# EAGLE design ! NES_IO_US_NOCUT_REV1.5 (EAGLE 9.1.3)
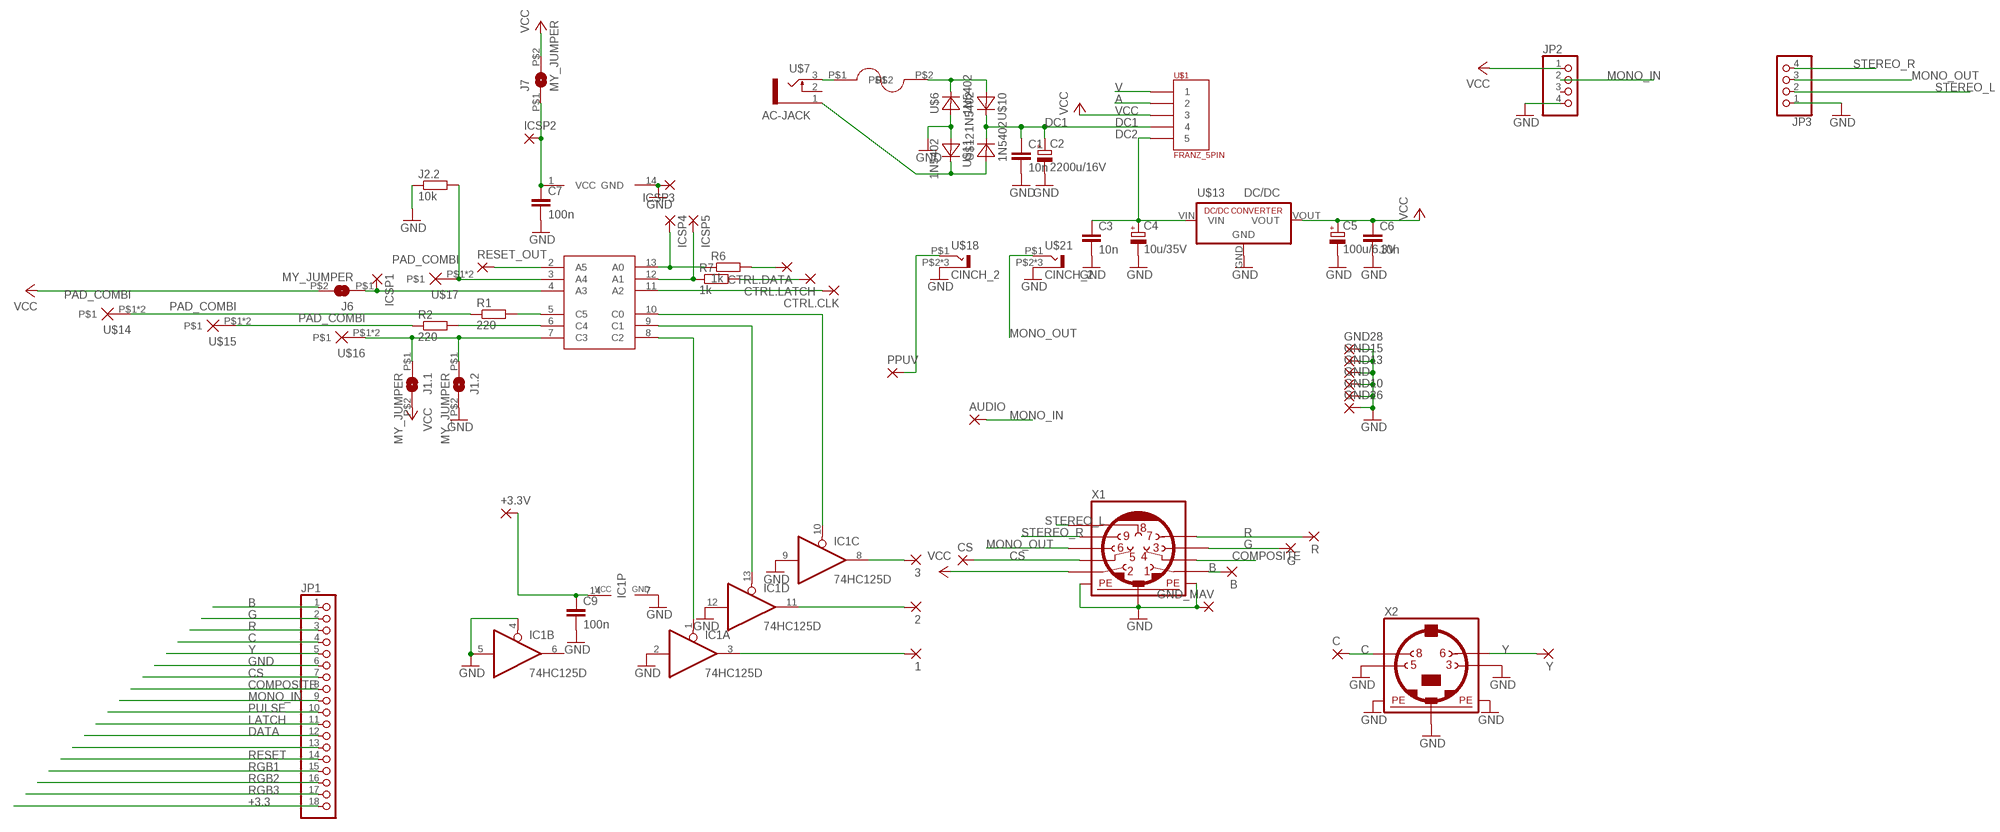
[diagram p0: schematic, sheet 1]

## Parts
1  SMD2  [SMD1,27-2,54]
2  SMD2  [SMD1,27-2,54]
3  SMD2  [SMD1,27-2,54]
+3.3V  SMD2  [SMD1,27-2,54]
AUDIO  SMD2  [SMD1,27-2,54]
B  SMD2  [SMD1,27-2,54]
C  SMD2  [SMD1,27-2,54]
C1  10n  C0805  [Z0805]
C2  2200u/16V  CPOL-EUE5-13  [E5-13]
C3  10n  C0805  [Z0805]
C4  10u/35V  CPOL-EUB  [PANASONIC_B]
C5  100u/6.3V  CPOL-EUD  [PANASONIC_D]
C6  10n  C0805  [Z0805]
C7  100n  C0805  [Z0805]
C9  100n  C0805  [Z0805]
CS  SMD2  [SMD1,27-2,54]
CTRL.CLK  SMD2  [SMD1,27-2,54]
CTRL.DATA  SMD2  [SMD1,27-2,54]
CTRL.LATCH  SMD2  [SMD1,27-2,54]
G  SMD2  [SMD1,27-2,54]
GND  SMD5  [SMD2,54-5,08]
GND10  SMD5  [SMD2,54-5,08]
GND13  SMD5  [SMD2,54-5,08]
GND15  SMD5  [SMD2,54-5,08]
GND26  SMD5  [SMD2,54-5,08]
GND28  SMD5  [SMD2,54-5,08]
GND_MAV  SMD2  [SMD1,27-2,54]
IC1  74HC125D  [SO14]
ICSP1  1,6/0,8  [1,6/0,8]
ICSP2  1,6/0,8  [1,6/0,8]
ICSP3  1,6/0,8  [1,6/0,8]
ICSP4  1,6/0,8  [1,6/0,8]
ICSP5  1,6/0,8  [1,6/0,8]
J1.1  MY_JUMPER  [MYJUMP]
J1.2  MY_JUMPER  [MYJUMP]
J2.2  10k  R0805  [Z0805]
J6  MY_JUMPER  [MYJUMP]
J7  MY_JUMPER  [MYJUMP]
JP1  PINHD-1X18_2.00  [1X18M]
JP2  PINHD-1X04_2.54-S  [1X04-S]
JP3  PINHD-1X04_2.54-S  [1X04-S]
PPUV  SMD2  [SMD1,27-2,54]
R  SMD2  [SMD1,27-2,54]
R1  220  R0805  [Z0805]
R2  220  R0805  [Z0805]
R6  1k  R0805  [Z0805]
R7  1k  R0805  [Z0805]
RESET_OUT  SMD2  [SMD1,27-2,54]
U$1  FRANZ_5PIN  [5X2.22RM4]
U$2  FUSEHOLDER  [FUSEHOLDER]
U$5  PIC16F630_SIMPLE  [PIC16F630]
U$6  1N5402  [DO201]
U$7  AC-JACK  [AC-JACK]
U$10  1N5402  [DO201]
U$11  1N5402  [DO201]
U$12  1N5402  [DO201]
U$13  DC/DC  [RECOM]
U$14  PAD_COMBI  [PAD_COMBI]
U$15  PAD_COMBI  [PAD_COMBI]
U$16  PAD_COMBI  [PAD_COMBI]
U$17  PAD_COMBI  [PAD_COMBI]
U$18  CINCH_2  [CINCH_2]
U$21  CINCH_2  [CINCH_2]
X1  MINI_DIN_9  [M_DIN9]
X2  MINI_DIN_4  [M_DIN4]
Y  SMD2  [SMD1,27-2,54]

## Nets
+3.3: +3.3V.1(P) C9.1 IC1.14(P:VCC) JP1.18
A: U$1.P$2
AC1A: U$2.P$1 U$7.3
AC1B: U$2.P$2 U$6.C U$10.A
AC2: U$7.1 U$11.C U$12.A
B: B.1(P) JP1.1 X1.1
C: C.1(P) JP1.4 X2.8
COMPOSITE: JP1.8 PPUV.1(P) U$18.P$1(T) X1.4
CS: CS.1(P) JP1.7 X1.5
DATA: CTRL.DATA.1(P) JP1.12 R6.2
DC1: C1.1 C2.+ U$1.P$4 U$10.C U$12.C
DC2: C3.1 C4.+ U$1.P$5 U$13.VIN
G: G.1(P) JP1.2 X1.3
GND: C1.2 C2.- C3.2 C4.- C5.- C6.2 C7.2 C9.2 GND10.1(P) GND13.1(P) GND15.1(P) GND26.1(P) GND28.1(P) GND.1(P) GND_MAV.1(P) IC1.2(A:I) IC1.4(B:OE) IC1.5(B:I) IC1.7(P:GND) IC1.9(C:I) IC1.12(D:I) ICSP3.1(P) J1.2.P$2 J2.2.1 JP1.6 JP2.4 JP3.1 U$5.14(GND) U$6.A U$11.A U$13.GND U$18.P$2(S) U$18.P$3(S) U$18.P$4(S) U$21.P$2(S) U$21.P$3(S) U$21.P$4(S) X1.SH1(PE1) X1.SH2(PE2) X1.SH3(PE3) X2.3 X2.5 X2.SH1(PE1) X2.SH2(PE2) X2.SH3(PE3)
LATCH: CTRL.LATCH.1(P) JP1.11 R7.2
MONO_IN: AUDIO.1(P) JP1.9 JP2.2
MONO_OUT: JP3.3 U$21.P$1(T) X1.6
N$12: J2.2.2 U$5.3(A4) U$17.P$1 U$17.P$2
N$13: R1.2 U$5.5(C5)
N$14: R2.2 U$5.6(C4)
N$15: R1.1 U$14.P$1 U$14.P$2
N$16: R2.1 U$15.P$1 U$15.P$2
N$17: J1.1.P$1 J1.2.P$1 U$5.7(C3) U$16.P$1 U$16.P$2
N$23: IC1.10(C:OE) U$5.10(C0)
N$24: IC1.13(D:OE) U$5.9(C1)
N$25: IC1.1(A:OE) U$5.8(C2)
N$29: JP1.13
N$31: C7.1 ICSP2.1(P) J7.P$1 U$5.1(VCC)
N$32: ICSP1.1(P) J6.P$1 U$5.4(A3)
N$33: ICSP4.1(P) R6.1 U$5.13(A0)
N$34: ICSP5.1(P) R7.1 U$5.12(A1)
PULSE: CTRL.CLK.1(P) JP1.10 U$5.11(A2)
R: JP1.3 R.1(P) X1.7
RESET: JP1.14 RESET_OUT.1(P) U$5.2(A5)
RGB1: 3.1(P) IC1.8(C:O) JP1.15
RGB2: 2.1(P) IC1.11(D:O) JP1.16
RGB3: 1.1(P) IC1.3(A:O) JP1.17
STEREO_L: JP3.2 X1.8
STEREO_R: JP3.4 X1.9
V: U$1.P$1
VCC: C5.+ C6.1 J1.1.P$2 J6.P$2 J7.P$2 JP2.1 U$1.P$3 U$13.VOUT X1.2
Y: JP1.5 X2.6 Y.1(P)
Unconnected: IC1.6(B:O) JP2.3 U$7.2

## Library data of the parts
1-3 +3.3V AUDIO B C CS CTRL.CLK CTRL.DATA CTRL.LATCH G GND_MAV PPUV R RESET_OUT Y = wirepad:SMD2: SMD PAD
C1 C3 C6 C7 C9 = snes_div:C0805
C2 = resistor:CPOL-EU: POLARIZED CAPACITOR, European symbol
C4 C5 = rcl:CPOL-EU: POLARIZED CAPACITOR, European symbol
GND GND10 GND13 GND15 GND26 GND28 = wirepad:SMD5: SMD PAD
IC1 = 74xx-eu:74*125: Quad bus BUFFER, 3-state
ICSP1-ICSP5 = wirepad:1,6/0,8: THROUGH-HOLE PAD
J1.1 J1.2 J6 J7 = snes_div:MY_JUMPER
J2.2 R1 R2 R6 R7 = snes_div:R0805
JP1 = pinhead-2:PINHD-1X18: PIN HEADER
JP2 JP3 = pinhead-2:PINHD-1X04: PIN HEADER
U$1 = schnaustlib:FRANZ_5PIN
U$2 = nintendo:FUSEHOLDER
U$5 = snes_div:PIC16F630_SIMPLE
U$6 U$10-U$12 = nintendo:1N5402
U$7 = nintendo:AC-JACK
U$13 = nintendo:DC/DC
U$14-U$17 = MS_Mod:PAD_COMBI
U$18 U$21 = nintendo:CINCH_2
X1 = mini_din:MINI_DIN_9
X2 = mini_din:MINI_DIN_4

## Board
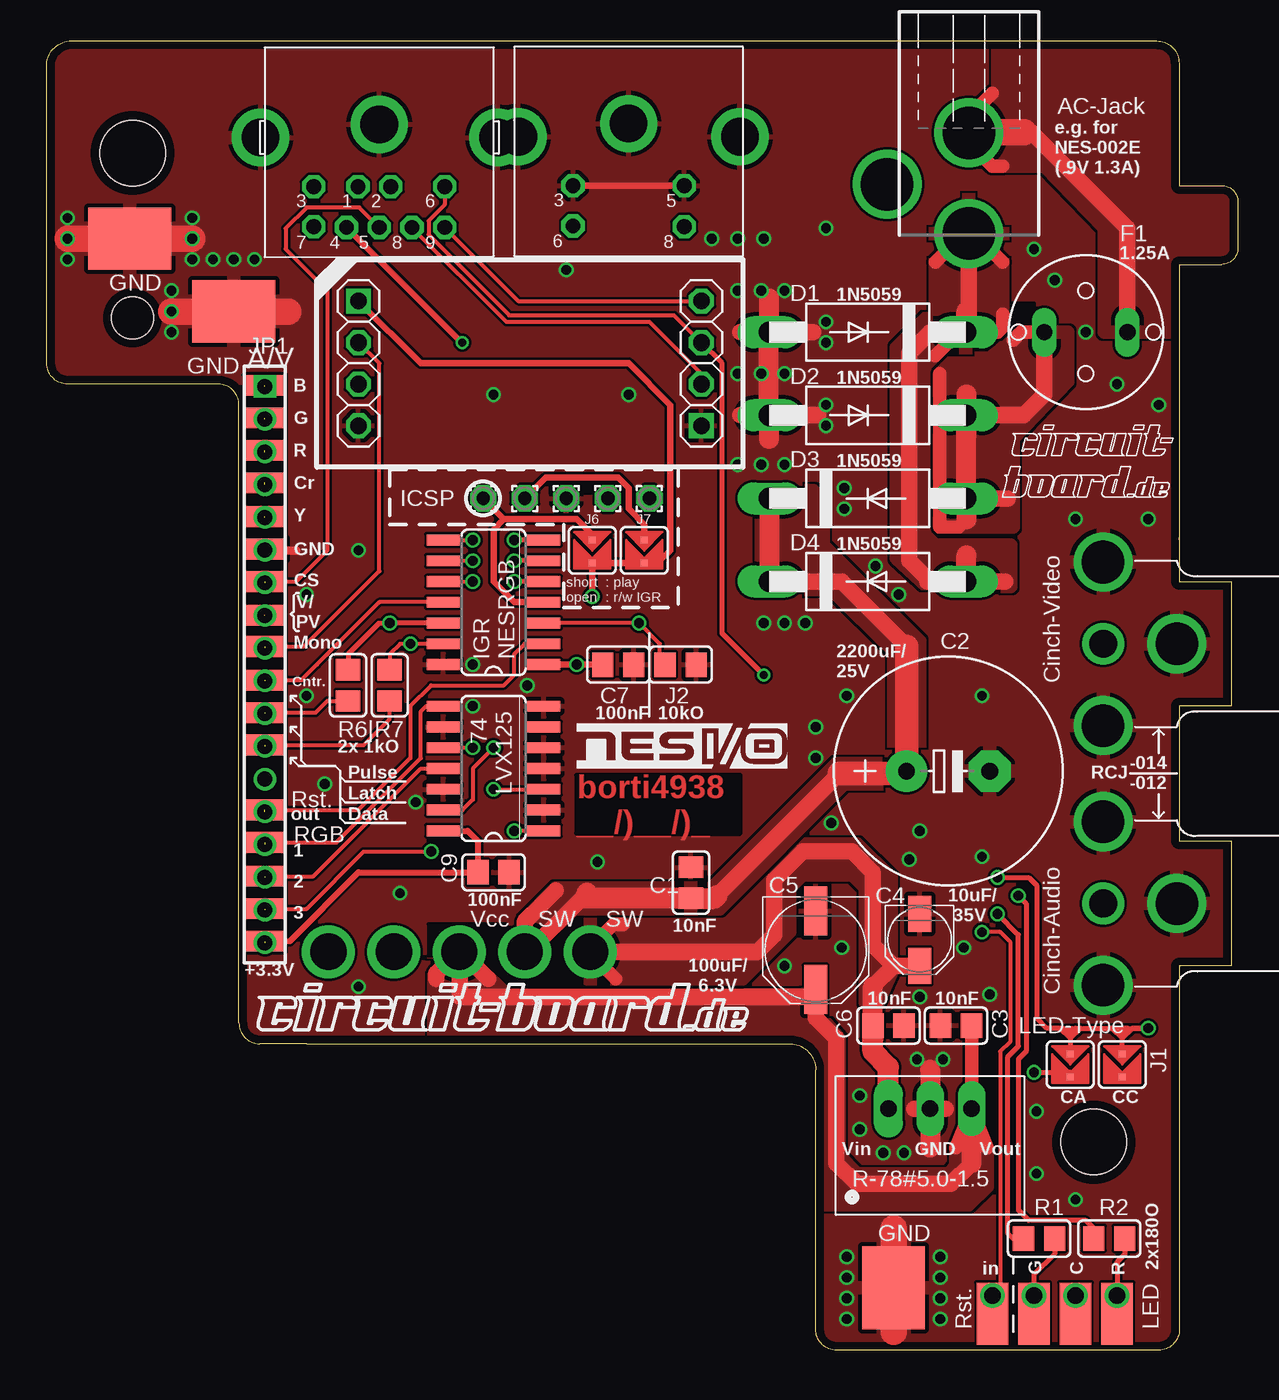
[diagram p1: board, top side]
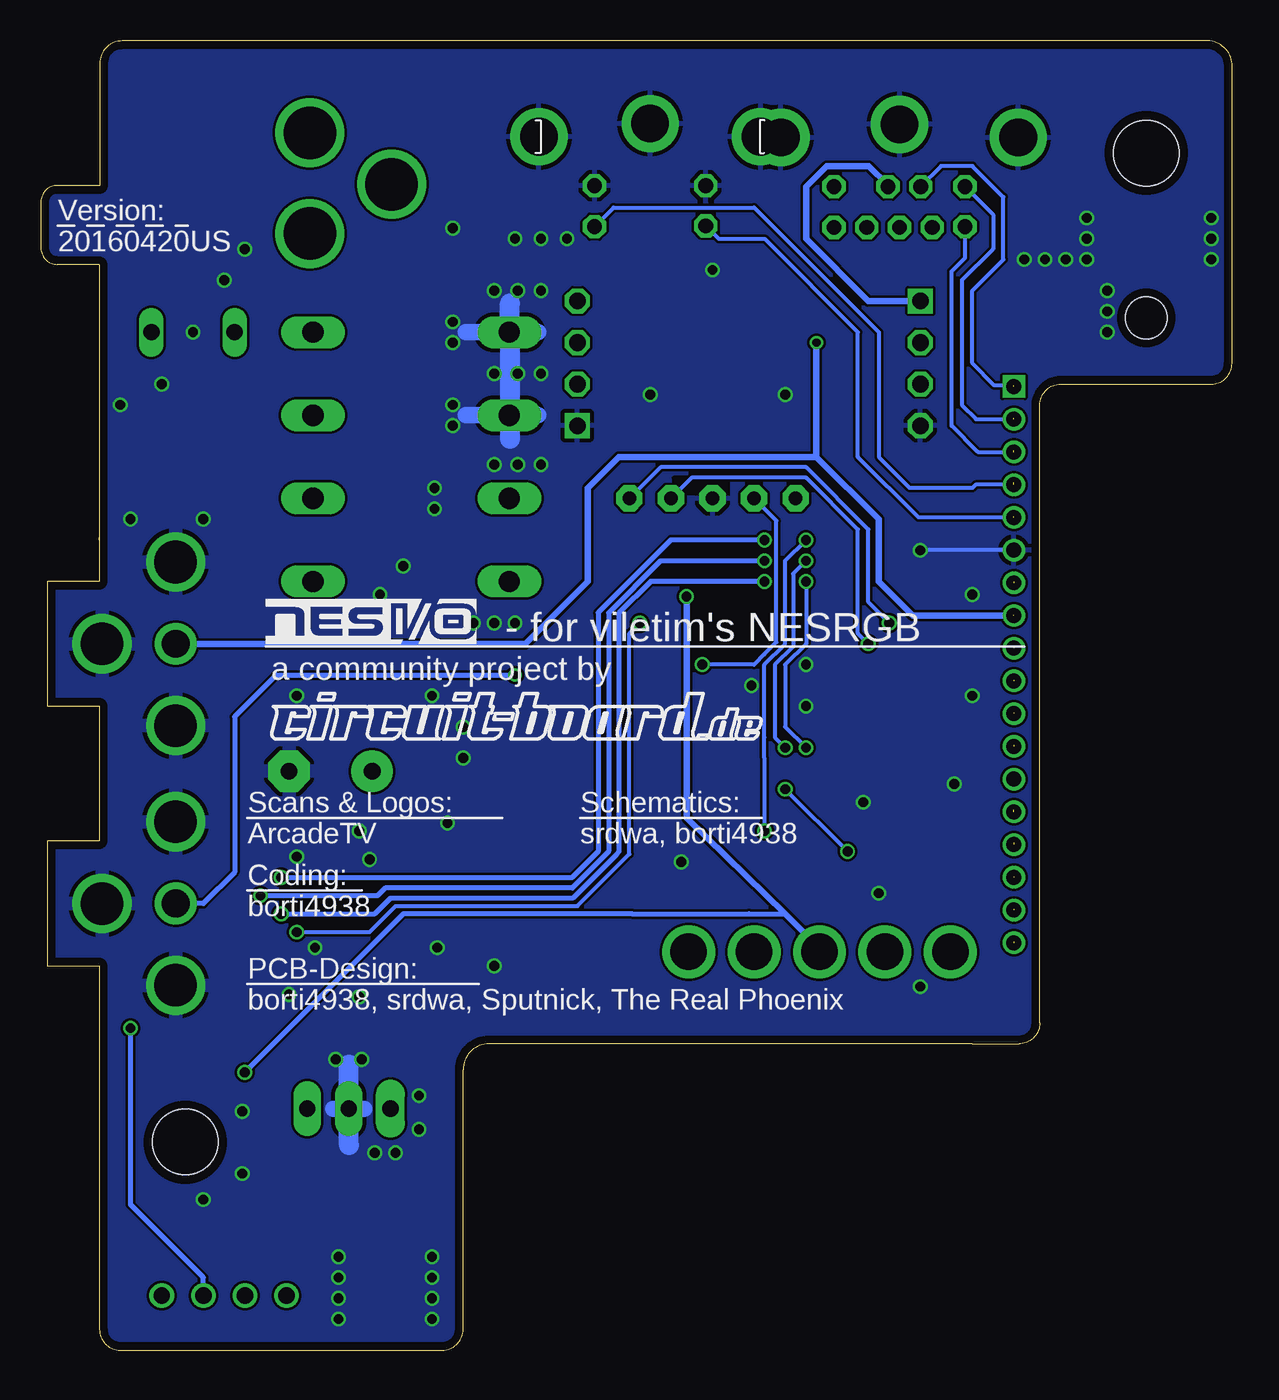
[diagram p2: board, bottom side, seen from below]

Size 72.8 x 80.04 mm. Coordinates in mm from the lower left corner, seen from the top.
Outline: 69.22,49.69 69.22,66.37 71.8,66.37 arc90 72.8,67.37 72.8,70.2 arc90 71.8,71.2 69.2,71.2 69.2,78.67 arc90 67.84,80.04 1.37,80.04 arc90 0.01,78.36 0.01,60.96 0.01,60.33 arc90 1.28,59.05 10.49,59.05 arc-90 11.76,57.78 11.76,20 arc90 13.03,18.73 15.88,18.73 29.85,18.73 45.41,18.73 arc-90 47,17.14 47,1.27 arc90 48.27,0 67.95,0 arc90 69.22,1.27 69.22,23.5 72.4,23.5 72.4,31.11 69.22,31.11 69.22,39.37 72.4,39.37 72.4,46.99 69.22,46.99 69.22,49.53
Outline: 69.22,49.69 69.22,49.53
Outline: 69.22,49.53 arc-7 69.22,49.69
Copper layers (1*16): Top 0.035mm / dielectric 1.6mm / Bottom 0.035mm
Design rules "Elecrow_2-layer_PCB_eagle_rule": minimum track width 6mil, minimum drill 12mil, track to track 6mil, track to pad 6mil, pad to pad 6mil, via to via 8mil, smd to smd 0mil, copper to edge 20mil, drill to drill 10mil, minimum pad ring 6mil, minimum via ring 6mil, stop-mask expansion 0mil, vias tented up to drill 100mil, thermal gap 10mil
Holes 4 mm at 5.26,73.16 63.99,12.73
Holes 2.54 mm at 5.26,63.11
tRestrict: area 62,10.7 to 66,14.7; area 3.2,71.2 to 7.3,75.2; area 23.3,24.1 to 28.1,26; area 30.8,52.4 to 34.1,53.3; area 12.1,24.3 to 14.6,59.7; area 59.1,62.5 to 60.3,64; area 57.3,13.3 to 58.6,20.6
bRestrict: area 62,10.7 to 66,14.7; area 3.2,71.2 to 7.3,75.2; area 30.8,52.4 to 34.1,53.3

### Footprints (pad centres in the part's own frame; a part is rotated, then mirrored left to right if it is on the bottom)
SMD1,27-2,54 = smd 1.27 x 2.54: 1 0,0
Z0805 = smd 1.3 x 1.5: 1 -0.95,0; 2 0.95,0
E5-13 = drill 1.016 pad 2.54: + -2.54,0 | drill 1.016 pad 2.54 octagon: - 2.54,0
PANASONIC_B = smd 2.2 x 1.4: + 1.6,0; - -1.6,0
PANASONIC_D = smd 3 x 1.4: + 2.4,0; - -2.4,0
SMD2,54-5,08 = smd 2.54 x 5.08: 1 0,0
SO14 = smd 0.66 x 2.032: 1 -3.81,-3.073; 2 -2.54,-3.073; 3 -1.27,-3.073; 4 0,-3.073; 5 1.27,-3.073; 6 2.54,-3.073; 7 3.81,-3.073; 8 3.81,3.073; 9 2.54,3.073; 10 1.27,3.073; 11 0,3.073; 12 -1.27,3.073; 13 -2.54,3.073; 14 -3.81,3.073
1,6/0,8 = drill 0.813 pad 1.6 octagon: 1 0,0
MYJUMP = smd 0.406 x 0.406: P$1 -0.635,0; P$2 0.765,0
1X18M = drill 0.914 square: 1 -17,0 | drill 0.914: 2 -15,0; 3 -13,0; 4 -11,0; 5 -9,0; 6 -7,0; 7 -5,0; 8 -3,0; 9 -1,0; 10 1,0; 11 3,0; 12 5,0; 13 7,0; 14 9,0; 15 11,0; 16 13,0; 17 15,0; 18 17,0
1X04-S = drill 1.016 square: 1 -3.81,0 | drill 1.016 octagon: 2 -1.27,0; 3 1.27,0; 4 3.81,0
5X2.22RM4 = drill 2.22: P$1 -8,0; P$2 -4,0; P$3 0,0; P$4 4,0; P$5 8,0
FUSEHOLDER = drill 1 pad 1.422 long: P$1 -2.54,0; P$2 2.54,0
PIC16F630 = smd 0.66 x 2.032: 1 -3.81,-3.073; 2 -2.54,-3.073; 3 -1.27,-3.073; 4 0,-3.073; 5 1.27,-3.073; 6 2.54,-3.073; 7 3.81,-3.073; 8 3.81,3.073; 9 2.54,3.073; 10 1.27,3.073; 11 0,3.073; 12 -1.27,3.073; 13 -2.54,3.073; 14 -3.81,3.073
DO201 = drill 1.3 long: A 6,0; C -6,0
AC-JACK = drill 3.2 pad 4: 1 0,8.57; 2 5,5.57; 3 0,2.42
RECOM = drill 1 pad 1.676 long: GND 0,0; VOUT 2.54,0 | drill 1 pad 1.778 long: VIN -2.54,0
PAD_COMBI = smd 1.93 x 3.81: P$1 0,0 | drill 1: P$2 0,1.111
CINCH_2 = drill 1.7: P$1 0,-4.5 | drill 2.6: P$2 -5,-4.5; P$3 5,-4.5; P$4 0,0
M_DIN9 = drill 0.9 pad 1.422 octagon: 1 -1.3,-3.8; 2 0.7,-3.8; 3 -4,-3.8; 4 -2,-6.3; 5 0,-6.3; 6 4,-3.8; 7 -4,-6.25; 8 2,-6.3; 9 4,-6.3 | drill 2.3 pad 3.5: SH1 7.25,-0.8; SH2 0,0; SH3 -7.25,-0.8
M_DIN4 = drill 0.9 pad 1.422 octagon: 3 -3.4,-3.75; 5 3.4,-3.75; 6 -3.4,-6.2; 8 3.4,-6.25 | drill 2.3 pad 3.5: SH1 6.8,-0.75; SH2 0,0.05; SH3 -6.75,-0.75

### Placement (x,y rotation side)
1  13.34,26.99 270 top
2  13.34,28.97 270 top
3  13.34,31.04 270 top
+3.3V  13.34,25 90 top
AUDIO  13.34,43.02 90 top
B  13.34,58.98 90 top
C  13.34,53.02 90 top
C1  39.38,28.57 90 top
C2  55.09,35.4 0 top
C3  51.44,19.84 0 top
C4  53.35,25.08 270 top
C5  47,24.45 270 top
C6  55.57,19.84 180 top
C7  34.93,41.91 0 top
C9  27.31,29.21 0 top
CS  13.34,46.99 90 top
CTRL.CLK  13.34,40.96 270 top
CTRL.DATA  13.34,36.99 270 top
CTRL.LATCH  13.34,38.97 270 top
G  13.34,56.99 90 top
GND  5.09,68.58 90 top
GND10  51.13,3.81 180 top
GND13  52.4,3.81 0 top
GND15  11.44,62.87 90 top
GND26  11.44,64.14 90 top
GND28  5.09,67.31 90 top
GND_MAV  13.34,48.97 270 top
IC1  27.31,35.56 90 top
ICSP1  26.68,52.07 0 top
ICSP2  29.22,52.07 0 top
ICSP3  31.76,52.07 0 top
ICSP4  34.3,52.07 0 top
ICSP5  36.84,52.07 0 top
J1.1  62.56,17.46 270 top
J1.2  65.73,17.46 270 top
J2.2  38.74,41.91 180 top
J6  33.35,48.9 270 top
J7  36.52,48.9 270 top
JP1  13.34,41.91 270 top
JP2  19.06,60.33 270 top
JP3  40.01,60.33 90 top
PPUV  13.34,44.93 90 top
R  13.34,55.01 90 top
R1  60.65,6.83 180 top
R2  64.94,6.83 180 top
R6  20.96,40.64 270 top
R7  18.42,40.64 270 top
RESET_OUT  13.34,33.02 90 top
U$1  25.22,24.36 0 top
U$2  63.51,62.23 180 top
U$3  [NESIO-LOGO]  32.39,35.56 0 top
U$4  [NESIO-LOGO]  59.06,43.18 0 bottom
U$5  27.31,45.72 90 top
U$6  50.17,57.15 180 top
U$7  56.36,76.83 180 top
U$10  50.17,52.07 0 top
U$11  50.17,62.23 180 top
U$12  50.17,46.99 0 top
U$13  53.98,14.76 0 top
U$14  60.33,2.22 0 top
U$15  65.41,2.22 0 top
U$16  62.87,2.22 0 top
U$17  57.79,2.22 0 top
U$18  69.06,43.18 270 top
U$21  69.06,27.3 270 top
X1  20.33,74.93 0 top
X2  35.57,74.93 0 top
Y  13.34,50.96 90 top

### Tracks (layer width: path | path; a pad name or v marks a point on that pad's centre or on a via)
+3.3  (1 unrouted)
  Top 0.254: C9.1
  Top 0.336: +3.3V.1 14.85,25 19.06,29.21
  Top 0.356: C9.1 26.36,31.11 25.73,31.75 IC1.14 | 19.06,29.21 C9.1
AC1A
  Top 0.813: 56.21,74.61 56.21,75.25 | 56.21,75.25 57.79,76.83 | 56.21,75.25 55.73,74.77 55.73,74.45 57.79,72.39 58.43,72.39
  Top 1.016: U$7.3 60.17,74.45 66.05,68.58 U$2.P$1
  Top 1.626: 59.7,74.45 56.21,74.45 56.21,74.61 56.21,74.77 56.05,74.61 56.05,74.45
  pour Top: 58.11,72.39 58.11,81.28 69.38,81.28 72.87,77.79 72.87,62.23 64.62,62.23 64.62,68.58 60.97,72.39
AC1B
  Top 0.813: U$2.P$2 59.54,62.23 59.06,61.75 | 54.59,59.69 54.59,50.32 55.73,50.32 56.21,50.8
  Top 1.016: U$6.C 56.21,57.15 59.7,57.15 60.97,58.42 60.97,61.75 | 56.21,52.07 58.75,52.07
  Top 1.219: U$6.C U$10.A | 56.21,52.07 56.21,50.8 | 56.21,55.88 56.21,57.15 56.21,58.42
  pour Top (rank 2): 54.3,50.32 59.06,50.32 59.06,55.72 62.4,59.21 62.4,62.23 59.54,62.23 57.63,60.64 55.09,60.64 54.3,59.85
AC2
  Top 0.813: 58.43,66.52 56.36,68.58 56.13,68.34 | 56.13,68.34 54.3,66.52 | U$7.1 56.13,68.27 56.13,68.34 | 56.21,62.23 58.11,62.23 58.43,62.55 58.43,63.34 | 54.3,60.8 55.89,62.39
  Top 1.016: U$7.1 56.36,62.23 56.21,62.23 U$11.C 53.98,62.23 52.71,60.96 52.71,48.26 53.98,46.99 U$12.A | 58.59,46.99 53.82,46.99
  Top 1.219: 56.21,62.23 56.21,63.5 | 56.21,46.99 56.21,48.58
  pour Top: 57.16,70.33 55.57,70.33 54.3,69.06 54.3,63.66 51.92,61.28 51.92,48.42 53.82,46.67 58.9,46.67 58.9,49.21 54.3,49.21 53.67,49.85 53.67,60.17 54.78,61.28 57.16,61.28 58.43,62.55 58.43,69.06
B  (1 unrouted)
  Bottom 0.254: JP1.1 13.41,58.98 14.53,58.98 15.88,60.33 15.88,64.77 13.98,66.67 13.98,70.48 15.88,72.39 17.79,72.39 19.03,71.15 X1.1
C  (1 unrouted)
  Bottom 0.254: JP1.4 15.68,52.91 15.88,52.7 19.69,52.7 21.6,54.61 21.6,62.23 29.22,69.85 37.8,69.85 X2.8
COMPOSITE  (via drill 0.5)  (1 unrouted)
  Top 0.406: X1.4 25.36,61.59 v25.41,61.59
  Bottom 0.406: 25.41,54.61 37.47,54.61 39.38,52.7 39.38,46.99 43.19,43.18 46.05,43.18 46.06,43.17 46.08,43.18 U$18.P$1 | JP1.8 19.52,44.91 21.6,46.99 21.6,50.8 25.41,54.61 | 25.41,54.61 v25.41,61.59
CS  (1 unrouted)
  Top 0.254: CS.1 15.25,46.99 17.15,48.9 17.15,64.77 14.61,67.31 14.61,68.58 15.88,69.85 19.11,69.85 X1.5
DATA  (1 unrouted)
  Top 0.254: R6.2 20.96,38.58 19.38,36.99 CTRL.DATA.1
DC1
  Top 0.813: 29.22,26.35 29.54,26.67
  Top 1.016: U$12.C 48.59,46.99 52.55,43.02 | 48.43,35.24 40.97,27.78 | U$1.P$4 | 32.71,27.62 29.22,24.13 29.22,26.19 31.12,28.1
  Top 1.219: U$10.C U$12.C
  Top 1.27: 33.03,27.94 33.03,27.62 C1.1 40.81,27.62 40.97,27.78
  Top 1.422: 52.55,43.02 C2.+ | 52.55,35.24 48.43,35.24
  pour Top: 43.66,46.51 43.66,52.55 46.84,52.55 47.47,51.91 47.47,49.21 53.35,43.34 53.35,35.88 52.71,34.61 48.74,34.61 41.12,26.99 32.23,26.99 30.17,24.92 30.17,24.45 27.95,24.45 27.95,25.08 31.12,28.26 40.65,28.26 48.27,35.88 51.13,35.88 51.76,36.51 51.76,42.7 47.95,46.51
DC2
  Top 0.406: 53.36,23.5 C4.+
  Top 0.813: 35.25,26.04 34.62,26.04 33.03,24.45 34.77,22.7
  Top 1.016: U$1.P$5 43.42,24.36 44.46,25.4 44.46,28.73 46.2,30.48 49.22,30.48 50.49,29.21 50.49,24.77 51.76,23.5 | 51.76,23.5 53.34,23.5 C4.+ | 50.49,22.23 51.76,23.5 | 50.49,19.05 C3.1
  Top 1.219: C3.1 50.49,22.23
  Top 1.27: U$13.VIN 51.44,17.3 50.49,18.26 50.49,19.05
  pour Top (rank 2): 42.55,22.7 33.03,22.7 33.03,26.19 41.28,26.19 46.05,30.96 49.54,30.96 51.6,28.89 51.6,23.02 50.81,21.27 50.01,21.27 50.01,28.26 49.22,29.05 46.2,29.05 45.41,28.26 45.41,25.56
G  (1 unrouted)
  Bottom 0.254: JP1.2 15.64,56.91 16.52,57.78 16.52,65.41 14.61,67.31 14.61,69.42 X1.3
GND  (via drill 0.6)
  Top 0.406: X2.3 X2.5
  Top 0.508: GND_MAV.1 13.42,48.9 15.25,48.9
  Top 1.016: 10.17,64.14 GND26.1 | 42.39,57.15 44.14,57.15 47.16,57.15 | 46.84,62.23 44.14,62.23 42.39,62.23 | 53.03,14.76 U$13.GND 54.94,14.76
  Top 1.219: 44.14,64.29 44.14,62.23 44.14,57.15 44.14,55.72 | 53.98,17.14 U$13.GND 53.98,12.38
  Top 1.626: v1.28,67.94 v8.9,67.94 | v7.63,63.5 14.77,63.5 | 51.76,7.46 51.76,1.11
  Bottom 0.254: JP1.6 v19.06,48.91
  Bottom 1.016: 42.39,62.23 44.14,62.23 46.84,62.23 | 46.84,57.15 44.14,57.15 42.39,57.15 | 53.03,14.76 U$13.GND 54.94,14.76
  Bottom 1.219: 44.14,63.98 44.14,62.23 44.14,57.15 44.14,55.72 | 53.98,17.46 U$13.GND 53.98,12.54
  other vias: 29.38,40.64 33.66,29.84 11.44,66.67 10.17,66.67 8.9,69.22 7.63,64.77 7.63,62.23 1.28,69.22 1.28,66.67 12.71,66.67 19.06,22.23 43.82,44.45 21.6,27.94 45.09,23.5 48.9,5.71 48.9,4.45 48.9,3.17 48.9,1.91 54.62,5.71 54.62,4.45 54.62,3.17 54.62,1.91 60.49,14.61 62.87,9.21 26.04,39.37 47,38.1 42.24,54.13 43.66,64.77 45.09,64.77 42.24,59.69 47.63,61.59 52.08,46.2 52.71,30 53.35,31.75 67.95,57.78 67.32,50.8 53.35,21.59 57.63,21.75 52.4,12.06 57.16,40.01 43.66,59.69 42.24,64.77 49.7,15.56 47.63,62.87 48.59,24.61 51.13,12.06 15.88,40.01 35.57,58.42 47.63,56.52 47.63,57.78 26.04,41.91 60.33,67.31 47,36.2 45.09,59.69 50.65,47.94 63.51,62.23 65.41,59.05 61.6,65.41 45.09,44.45 62.87,50.8 57.16,30.16 48.9,40.01 48.74,52.7 47.95,32.23 48.74,51.44 22.55,33.5 46.36,44.45 60.49,10.79 31.76,66.04 27.31,58.42 56.05,24.61 49.7,13.49 53.19,17.78 54.78,17.78 16.99,34.61 42.24,67.94 43.66,54.13 45.09,54.13 40.65,67.94 43.82,67.94 15.88,46.2 47.63,68.58 8.9,66.67
  pour Top (rank 5): -1.26,58.42 -1.26,80.01 11.44,80.01 11.44,67.31 13.66,67.31 16.52,64.45 16.52,58.42
  pour Top (rank 5): 48.27,7.62 55.89,7.62 55.89,0 48.27,0
  pour Bottom (rank 5): 59.7,38.1 55.09,38.1 55.09,33.02 59.7,33.02
  pour Top (rank 5): 59.7,38.1 55.09,38.1 55.09,33.02 59.7,33.02
  pour Bottom: 62.24,50.48 73.03,50.64 73.03,20.16 62.24,20.16
  pour Top: 62.24,50.48 73.03,50.48 73.03,20.16 62.24,20.16
  pour Top (rank 6): 45.73,0 72.87,0 72.87,81.44 -1.26,81.44 -1.26,58.42 11.44,58.42 11.44,22.86 11.44,19.05 45.73,19.05
  pour Bottom (rank 6): 45.73,0 72.87,0 72.87,66.36 72.87,81.44 -1.9,81.44 -1.9,58.42 11.44,58.42 11.44,19.05 42.55,19.05 45.73,19.05
LATCH  (1 unrouted)
  Top 0.254: 18.42,39.53 R7.2 17.15,39.69 16.44,38.97 CTRL.LATCH.1
MONO_IN  (1 unrouted)
  Top 0.254: AUDIO.1 15.72,43.02 20.33,47.62 20.33,60.33 JP2.2
MONO_OUT  (via drill 0.5)
  Top 0.254: 40.02,61.59 JP3.3 38.34,63.27 28.26,63.27 23.34,68.19 23.34,69.04 24.33,70.03 X1.6
  Top 0.305: v43.82,41.27 41.28,43.81 41.28,60.33 JP3.3
  Bottom 0.305: v43.82,41.27 58.43,41.27 60.97,38.73 60.97,29.21 62.87,27.3 U$21.P$1
N$12  (via drill 0.6)
  Top 0.254: U$17.P$2 58.27,3.65 58.27,18.26 58.9,18.89 58.9,24.92 58.27,25.56 v57.16,25.56 | U$5.3 v36.2,44.45 37.47,43.18 37.47,41.91 J2.2.2
  Top 0.305: U$17.P$1 U$17.P$2
  Bottom 0.254: v57.16,25.56 52.71,25.56 51.13,27.15 40.01,27.15 36.84,30.32 36.84,43.81 v36.2,44.45
N$13  (via drill 0.6)
  Top 0.305: U$5.5 v28.58,46.99 | R1.2 59.06,6.83 58.75,7.14 58.75,17.94 59.38,18.57 59.38,25.4 v58.11,26.67
  Bottom 0.305: v58.11,26.67 52.4,26.67 51.44,27.62 40.65,27.62 40.31,27.62 37.65,30.28 37.65,30.3 37.47,30.48 37.47,45.06 35.55,46.99 v28.58,46.99
N$14  (via drill 0.6)
  Top 0.305: U$5.6 v28.58,48.26 | R2.2 63.99,7.46 63.51,7.94 60.02,7.94 59.38,8.57 59.38,17.78 59.86,18.26 59.86,27.3 v59.38,27.78
  Bottom 0.305: v59.38,27.78 52.24,27.78 51.76,28.26 40.32,28.26 38.29,30.29 38.29,30.3 38.11,30.48 38.11,45.07 34.92,48.26 v28.58,48.26
N$15
  Top 0.305: U$14.P$1 U$14.P$2 60.33,4.6 61.6,5.87 R1.1
N$16
  Top 0.305: U$15.P$1 U$15.P$2 65.41,5.4 65.89,5.87 R2.1
N$17  (via drill 0.6)
  Top 0.305: U$5.7 v28.58,49.53 | U$16.P$1 U$16.P$2 | 62.56,19.05 J1.1.P$1 | 65.41,18.41 J1.2.P$1 65.73,19.05 | 62.56,19.05 61.92,19.68 | 65.73,19.05 65.1,19.68 | 61.92,19.68 62.87,19.68 | 62.87,19.68 63.19,19.68 | 63.19,19.68 62.56,19.05 | 62.56,19.05 62.56,19.21 62.24,19.53 62.56,19.53 62.71,19.37 62.71,19.53 62.87,19.68 | 63.19,19.68 65.1,19.68 | 65.1,19.68 65.25,19.68 | 65.25,19.68 65.73,19.68 | 66.05,19.68 v67.32,19.68 66.37,19.68 65.73,19.05 | 65.73,19.05 65.73,19.37 66.05,19.68 | 66.05,19.68 65.73,19.68 | 65.73,19.68 65.57,19.53 65.41,19.53 65.25,19.68 | 61.92,19.68 61.13,19.68 60.49,20.32 60.49,28.42 60.02,28.89 v58.11,28.89
  Bottom 0.305: v58.11,28.89 40.33,28.89 38.74,30.48 38.74,45.09 34.3,49.53 v28.58,49.53 | U$16.P$2 62.87,4.45 67.32,8.89 v67.32,19.68
N$23  (via drill 0.6)
  Top 0.254: 24.3,36.83 IC1.10 v26.04,36.83 | U$5.10 v26.04,46.99
  Bottom 0.254: v26.04,46.99 26.04,43.18 27.31,41.91 27.31,38.1 v26.04,36.83
N$24  (via drill 0.6)
  Top 0.254: U$5.9 v26.04,48.26 | v27.31,36.83 26.04,35.56 26.04,33.66 25.41,33.02 IC1.13
  Bottom 0.254: v26.04,48.26 26.84,47.47 26.84,43.02 27.95,41.91 27.95,37.47 v27.31,36.83
N$25  (via drill 0.6)
  Top 0.254: U$5.8 v26.04,49.53 | IC1.1 28.74,31.75 v28.58,31.75
  Bottom 0.254: v26.04,49.53 27.31,48.26 27.31,43.18 28.58,41.91 28.58,37.47 28.58,36.2 v28.58,31.75
N$31  (via drill 0.6)
  Top 0.305: C7.1 34.14,41.91 v32.39,41.91
  Top 0.406: C7.1 33.82,41.91 32.23,41.91 31.76,41.91 U$5.1 | ICSP2.1 30.49,53.34 34.93,53.34 35.57,52.7 35.57,51.44 36.52,50.48 J7.P$1
  Bottom 0.254: v32.39,41.91 29.22,41.91 28.58,42.55 27.85,43.28 27.85,50.7 ICSP2.1
N$32
  Top 0.406: 27.95,50.8 ICSP1.1 27.95,50.8 | J6.P$1 33.35,49.85 32.39,50.8 27.95,50.8 | U$5.4 28.58,45.72 27.31,46.99 27.31,50.16 27.95,50.8
N$33  (via drill 0.6)
  Top 0.254: R6.1 20.96,42.55 21.6,43.18 v22.23,43.18 U$5.13
  Bottom 0.254: v22.23,43.18 22.87,43.81 22.87,50.16 26.04,53.34 33.03,53.34 ICSP4.1
N$34  (via drill 0.6)
  Top 0.305: R7.1 18.42,41.43 18.42,42.55 20.33,44.45 v20.96,44.45 U$5.12
  Bottom 0.254: v20.96,44.45 22.23,45.72 22.23,50.16 26.04,53.98 34.93,53.98 ICSP5.1
PULSE  (1 unrouted)
  Top 0.254: U$5.11 20.33,45.72 17.15,42.55 16.52,41.91 15.57,40.96 CTRL.CLK.1
R  (1 unrouted)
  Bottom 0.254: JP1.3 15.55,54.91 17.15,56.52 17.15,65.95 16.33,66.78 X1.7
RESET  (1 unrouted)
  Top 0.254: U$5.2 29.22,43.18 28.58,42.55 28.58,41.27 27.95,40.64 23.5,40.64 22.23,39.37 22.23,36.83 22.23,36.67 22.23,36.2 19.06,33.02 RESET_OUT.1
RGB1  (1 unrouted)
  Top 0.254: IC1.8 23.19,39.37 22.87,39.05 22.87,36.2 17.79,31.11 | 17.71,31.04 17.79,31.11 | 3.1 17.71,31.04 | 17.71,31.04 17.79,31.11
RGB2  (1 unrouted)
  Top 0.254: IC1.11 22.87,35.56 16.28,28.97 2.1
RGB3  (via drill 0.6)  (1 unrouted)
  Top 0.254: v23.5,30.48 21.44,30.48 19.38,30.48 15.88,26.99 1.1 | v27.31,34.29 IC1.3
  Bottom 0.254: v23.5,30.48 v27.31,34.29
STEREO_L
  Top 0.254: X1.8 28.09,62.87 36.84,62.87 40.01,59.69 JP3.2
STEREO_R
  Top 0.254: X1.9 28.82,64.14 JP3.4
VCC  (via drill 0.6)
  Top 0.305: v60.33,16.99 62.53,16.99 J1.1.P$2
  Top 0.406: v33.35,46.07 J6.P$2 J7.P$2 37.29,48.26 37.47,48.26 38.11,48.9 38.11,57.78 35.57,60.33 22.87,60.33 JP2.1
  Top 0.813: U$13.VOUT 56.52,20 | U$13.VOUT 55.57,12.38 | U$13.VOUT 57.48,12.38
  Top 1.016: 56.52,20 C6.1 | U$1.P$3 25.22,24.32 25.25,24.29 | 25.25,24.29 25.25,21.59 46.54,21.59 C5.+ 47,20.32 48.27,19.05 48.27,11.43 49.54,10.16 55.25,10.16 56.52,11.43 | 25.25,24.29 25.09,24.29 23.82,23.02 23.82,22.7 | 25.25,24.45 27,22.7
  Top 1.219: 56.52,11.43 U$13.VOUT
  Bottom 0.305: 27.31,26.67 29.54,26.67 36.68,26.67 50.65,26.67 v60.33,16.99
  Bottom 0.406: U$1.P$3 25.22,24.58 27.31,26.67 33.35,32.54 v33.35,46.07 | JP2.1 22.23,64.14 26.04,67.94 26.04,71.12 24.77,72.39 22.2,72.39 21.03,71.22 X1.2
  pour Top (rank 3): 57.48,12.38 55.57,12.38 55.57,11.27 55.09,10.79 49.54,10.79 48.43,11.91 48.43,19.05 46.2,21.75 28.27,21.59 26.36,23.5 26.36,24.13 25.57,24.92 23.66,24.92 23.66,18.73 47,18.73 47,8.89 56.36,8.89 57.48,10
Y  (1 unrouted)
  Bottom 0.254: JP1.5 19.17,50.91 22.87,54.61 22.87,62.23 28.57,67.94 31.37,67.94 X2.6

### Text on the board
Top: borti4938 / __/)__/)_
tNames: AC-Jack | e.g. for / NES-002E / ( 9V 1.3A) | ~ | F1 | 1.25A | GND | D1 | 1N5059 | GND | A/V | B | D2 | 1N5059 | G | R | D3 | 1N5059 | Cr | ICSP | Y | J6 | J7 | GND | D4 | 1N5059 | CS | short / open | : play / : r/w IGR | V/ / PV | Mono | C2 | IGR / NESRGB | Cntr. | 2200uF/ / 25V | Cinch-Video | C7 | J2 | 74 / LVX125 | 100nF | 10kO | 2x | R6|R7 | 1kO | Pulse | RCJ | Latch | -014 / -012 | Rst. | out | Data | RGB | 1 | C9 | 2 | C1 | C5 | 100nF | C4 | 3 | Vcc | SW | SW | 10nF | 10uF/ / 35V | +3.3V | 100uF/ / 6.3V | Cinch-Audio | 10nF | 10nF | C6 | C3 | LED-Type | J1 | CA | CC | Vin | GND | Vout | R-78#5.0-1.5 | R1 | R2 | GND | in | G | C | R | 2x180O | Rst. | LED
bNames: Version: / 20160420US | - for viletim's NESRGB | a community project by | Schematics: / srdwa, borti4938 | Scans & Logos: / ArcadeTV | Coding: / borti4938 | PCB-Design: / borti4938, srdwa, Sputnick, The Real Phoenix
tStop: b | o | r | t | i | 4 | 9 | 3 | 8 | _ | _ | / | ) | _ | _ | / | ) | _